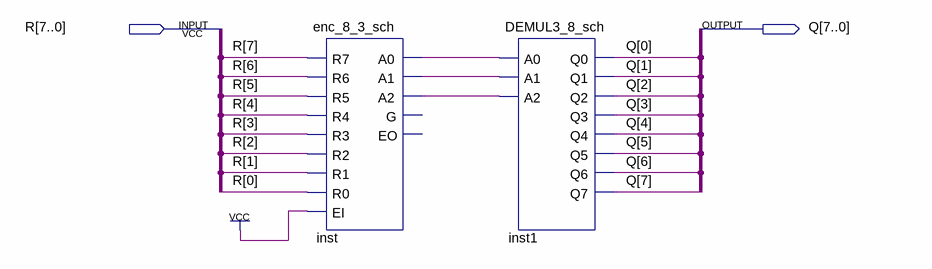
[diagram p0: schematic sheet]
// Quartus schematic Vector88.bdf as structural Verilog: 2 symbols, 2 pins
module Vector88 (
  input  [7:0] R,
  output [7:0] Q
);

  wire inst_a0, inst_a1, inst_a2;

  enc_8_3_sch inst (
    .R7(R[7]), .R6(R[6]), .R5(R[5]), .R4(R[4]), .R3(R[3]), .R2(R[2]), .R1(R[1]), .R0(R[0]), .EI(1'b1),
    .A0(inst_a0), .A1(inst_a1), .A2(inst_a2));  // open: G, EO
  DEMUL3_8_sch inst1 (
    .A0(inst_a0), .A1(inst_a1), .A2(inst_a2), .Q0(Q[0]), .Q1(Q[1]), .Q2(Q[2]), .Q3(Q[3]), .Q4(Q[4]),
    .Q5(Q[5]), .Q6(Q[6]), .Q7(Q[7]));
endmodule
